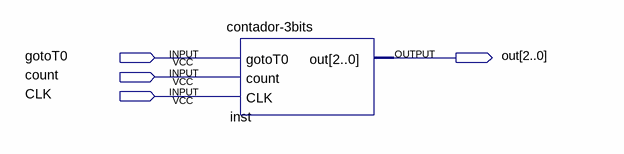
[diagram p0: schematic sheet]
// Quartus schematic main.bdf as structural Verilog: 1 symbols, 4 pins
module main (
  input  gotoT0,
  input  count,
  input  CLK,
  output [2:0] out
);

  \contador-3bits  inst (.gotoT0(gotoT0), .count(count), .CLK(CLK), .out(out));
endmodule
